# Altium schematic sheet microcontroller.SchDoc
size A; DocumentNumber: 3; SheetNumber: 3; SheetTotal: 7
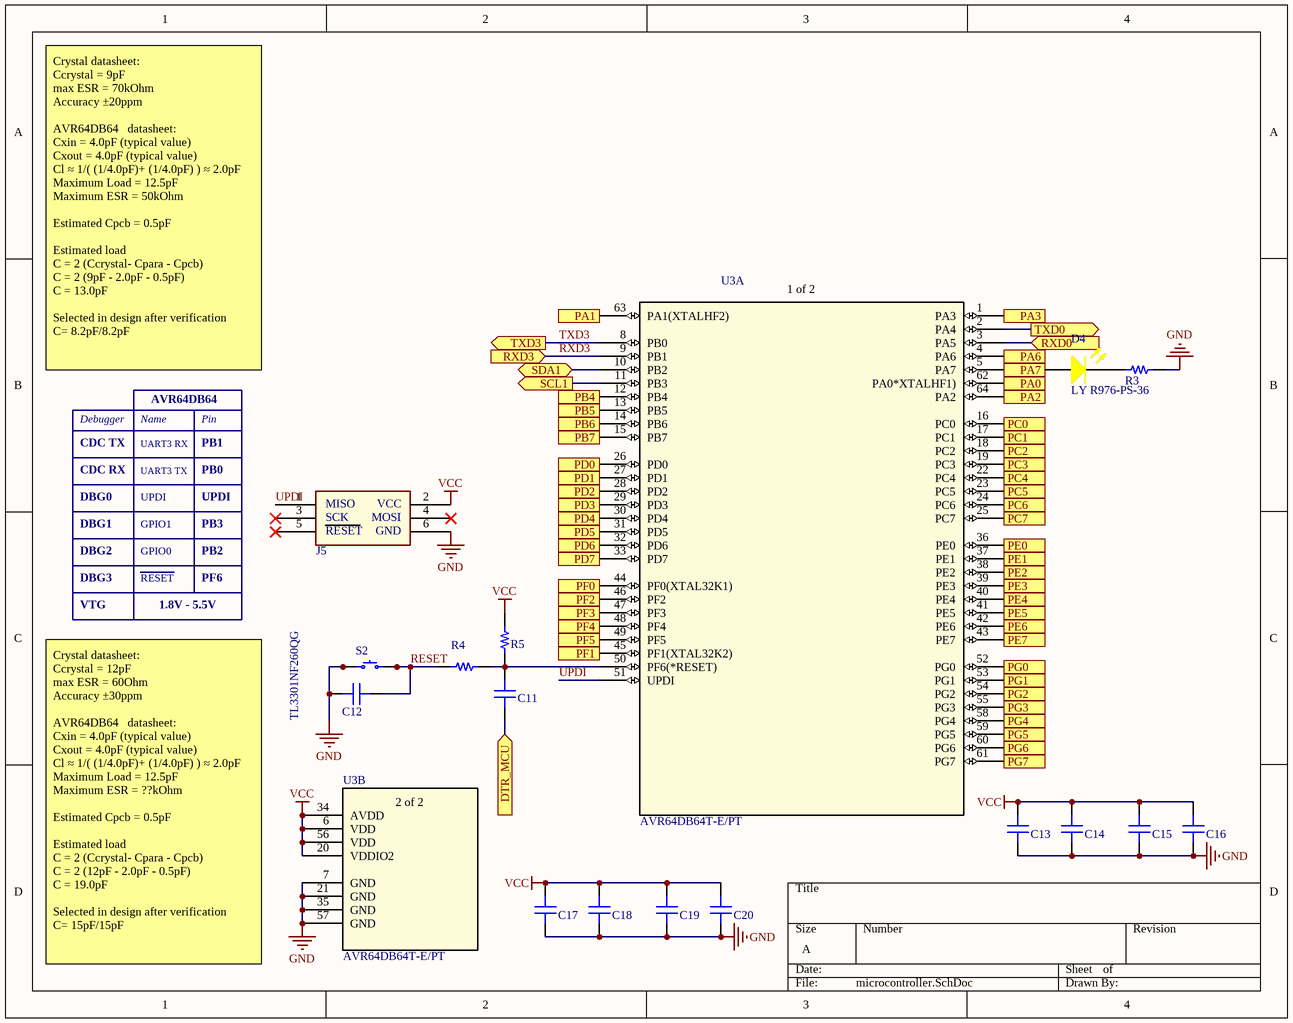
[diagram p0: microcontroller.SchDoc]

## Parts
C11  C0805C104M5RAC7025  [CAP SMD 0805]  (value not drawn)
C12  C0805C104M5RAC7025  [CAP SMD 0805]  (value not drawn)
C13  C0805C104M5RAC7025  [CAP SMD 0805]  (value not drawn)
C14  C0805C104M5RAC7025  [CAP SMD 0805]  (value not drawn)
C15  C0805C104M5RAC7025  [CAP SMD 0805]  (value not drawn)
C16  C0805C104M5RAC7025  [CAP SMD 0805]  (value not drawn)
C17  C0805C475K9PAC7210  [CAP SMD 0805]  (value not drawn)
C18  C0805C475K9PAC7210  [CAP SMD 0805]  (value not drawn)
C19  C0805C475K9PAC7210  [CAP SMD 0805]  (value not drawn)
C20  C0805C475K9PAC7210  [CAP SMD 0805]  (value not drawn)
D4  LY R976-PS-36  [LED 0805]
J5  HEADER 2x3  [2*3PIN_HEAD_2.54]  (value not drawn)
R3  1K  [RES SMD 0805]  (value not drawn)
R4  330R  [RES SMD 0805]  (value not drawn)
R5  10K  [RES SMD 0805]  (value not drawn)
S2  TL3301NF260QG  [Tactile Switche]
U3  AVR64DB64T-E/PT  [64-LQFP]  (parts A,B of 2)

## Ports
DTR_MCU (in), PA0 (out), PA1 (out), PA2 (out), PA3 (out), PA6 (out), PA7 (out), PB4 (out), PB5 (out), PB6 (out), PB7 (out), PC0 (out), PC1 (out), PC2 (out), PC3 (out), PC4 (out), PC5 (out), PC6 (out), PC7 (out), PD0 (out), PD1 (out), PD2 (out), PD3 (out), PD4 (out), PD5 (out), PD6 (out), PD7 (out), PE0 (out), PE1 (out), PE2 (out), PE3 (out), PE4 (out), PE5 (out), PE6 (out), PE7 (out), PF0 (out), PF1 (out), PF2 (out), PF3 (out), PF4 (out), PF5 (out), PG0 (out), PG1 (out), PG2 (out), PG3 (out), PG4 (out), PG5 (out), PG6 (out), PG7 (out), RXD0 (in), RXD3 (in), SCL1 (out), SDA1 (bidir), TXD0 (out), TXD3 (out)

## Nets
GND: C12.1 C13.1 C14.1 C15.1 C16.1 C17.1 C18.1 C19.1 C20.1 J5.6 R3.2 S2.1 S2.2 U3.7(GND) U3.21(GND) U3.35(GND) U3.57(GND)
VCC: C13.2 C14.2 C15.2 C16.2 C17.2 C18.2 C19.2 C20.2 J5.2 R5.2 U3.6(VDD) U3.20(VDDIO2) U3.34(AVDD) U3.56(VDD)
DTR_MCU: C11.1 ; port DTR_MCU
PA0: U3.62(PA0*XTALHF1)) ; port PA0
PA1: U3.63(PA1(XTALHF2)) ; port PA1
PA2: U3.64(PA2) ; port PA2
PA3: U3.1(PA3) ; port PA3
PA6: U3.4(PA6) ; port PA6
PA7: D4.2(Anode) U3.5(PA7) ; port PA7
PB4: U3.12(PB4) ; port PB4
PB5: U3.13(PB5) ; port PB5
PB6: U3.14(PB6) ; port PB6
PB7: U3.15(PB7) ; port PB7
PC0: U3.16(PC0) ; port PC0
PC1: U3.17(PC1) ; port PC1
PC2: U3.18(PC2) ; port PC2
PC3: U3.19(PC3) ; port PC3
PC4: U3.22(PC4) ; port PC4
PC5: U3.23(PC5) ; port PC5
PC6: U3.24(PC6) ; port PC6
PC7: U3.25(PC7) ; port PC7
PD0: U3.26(PD0) ; port PD0
PD1: U3.27(PD1) ; port PD1
PD2: U3.28(PD2) ; port PD2
PD3: U3.29(PD3) ; port PD3
PD4: U3.30(PD4) ; port PD4
PD5: U3.31(PD5) ; port PD5
PD6: U3.32(PD6) ; port PD6
PD7: U3.33(PD7) ; port PD7
PE0: U3.36(PE0) ; port PE0
PE1: U3.37(PE1) ; port PE1
PE2: U3.38(PE2) ; port PE2
PE3: U3.39(PE3) ; port PE3
PE4: U3.40(PE4) ; port PE4
PE5: U3.41(PE5) ; port PE5
PE6: U3.42(PE6) ; port PE6
PE7: U3.43(PE7) ; port PE7
PF0: U3.44(PF0(XTAL32K1)) ; port PF0
PF1: U3.45(PF1(XTAL32K2)) ; port PF1
PF2: U3.46(PF2) ; port PF2
PF3: U3.47(PF3) ; port PF3
PF4: U3.48(PF4) ; port PF4
PF5: U3.49(PF5) ; port PF5
PG0: U3.52(PG0) ; port PG0
PG1: U3.53(PG1) ; port PG1
PG2: U3.54(PG2) ; port PG2
PG3: U3.55(PG3) ; port PG3
PG4: U3.58(PG4) ; port PG4
PG5: U3.59(PG5) ; port PG5
PG6: U3.60(PG6) ; port PG6
PG7: U3.61(PG7) ; port PG7
RESET: C12.2 R4.2 S2.3 S2.4
RXD0: U3.3(PA5) ; port RXD0
RXD3: U3.9(PB1) ; port RXD3
SCL1: U3.11(PB3) ; port SCL1
SDA1: U3.10(PB2) ; port SDA1
TXD0: U3.2(PA4) ; port TXD0
TXD3: U3.8(PB0) ; port TXD3
UPDI: J5.1 U3.51(UPDI)
NetC11_2: C11.2 R4.1 R5.1 U3.50(PF6(*RESET))
NetD4_1: D4.1(Cathode) R3.1

Not connected (* = marked no-connect by the designer): J5 3* 4* 5*

## Notes on the sheet
- Crystal datasheet:
  Ccrystal = 9pF
  max ESR = 70kOhm
  Accuracy ±20ppm
  AVR64DB64   datasheet:
  Cxin = 4.0pF (typical value)
  Cxout = 4.0pF (typical value)
  Cl ≈ 1/( (1/4.0pF)+ (1/4.0pF) ) ≈ 2.0pF
  Maximum Load = 12.5pF
  Maximum ESR = 50kOhm
  Estimated Cpcb = 0.5pF
  Estimated load
  C = 2 (Ccrystal- Cpara - Cpcb)
  C = 2 (9pF - 2.0pF - 0.5pF)
  C = 13.0pF
  Selected in design after verification
  C= 8.2pF/8.2pF
- Debugger
- Name
- AVR64DB64
- Pin
- DBG0
- CDC TX
- CDC RX
- UPDI
- UART3 RX
- UART3 TX
- PB0
- PB1
- DBG1
- DBG2
- GPIO1
- GPIO0
- PB3
- PB2
- DBG3
- VTG
- RESET
- 1.8V - 5.5V
- PF6
- Crystal datasheet:
  Ccrystal = 12pF
  max ESR = 60Ohm
  Accuracy ±30ppm
  AVR64DB64   datasheet:
  Cxin = 4.0pF (typical value)
  Cxout = 4.0pF (typical value)
  Cl ≈ 1/( (1/4.0pF)+ (1/4.0pF) ) ≈ 2.0pF
  Maximum Load = 12.5pF
  Maximum ESR = ??kOhm
  Estimated Cpcb = 0.5pF
  Estimated load
  C = 2 (Ccrystal- Cpara - Cpcb)
  C = 2 (12pF - 2.0pF - 0.5pF)
  C = 19.0pF
  Selected in design after verification
  C= 15pF/15pF
- (in symbol AVR64DB64T-E/PT, part A) 1 of 2
- (in symbol AVR64DB64T-E/PT, part B) 2 of 2
- (in symbol HEADER 2x3) MISO; VCC; SCK; MOSI; RESET; GND

## Library data of the parts
C11-C16 = CAPACITOR X7R: 0.1 µF ±20% 50V Ceramic Capacitor X7R 0805 (2012 Metric)
C17-C20 = CAPACITOR X7R: 4.7 µF ±10% 6.3V Ceramic Capacitor X5R 0805 (2012 Metric)
D4 = SMD LED INDICATORS_2: LED YELLOW DIFFUSED 0805 SMD
J5 = HEADER 2x3: 2x3 pin header, 2.54 mm pitch, THM; PartGroup: Mechanical devices,Connectors,Pin headers; Manufacturer: SAMTEC; AN: A08-0538; Value: MTSW-103-08-L-D-276; TemperatureRange: max. 125 degrees; Height: 9,60000038146973; MPN: MTSW-103-08-L-D-276
R3 = RESISTOR_2: RES SMD 1K OHM 1% 1/4W 0805
R4 = RESISTOR: RES SMD 330 OHM 1% 1/4W 0805
R5 = RESISTOR: RES SMD 10K OHM 1% 1/4W 0805
S2 = 1571563-4: SWITCH TACTILE SPST-NO 0.05A 12V; Manufacturer: TE Connectivity ALCOSWITCH Switches; Actuator Height off PCB, Vertical: 5.00mm; Actuator Orientation: Top Actuated; Actuator Type: Standard; Contact Rating @ Voltage: 0.05A @ 24VDC; Illumination: Non-Illuminated; Operating Force: 260gf; Outline: 6.00mm x 6.00mm; Switch Function: Off-Mom; Part Number: 1571563-4; Circuit: SPST-NO; ComponentLink1Description: Datasheet; ComponentLink1URL: https://www.te.com/commerce/DocumentDelivery/DDEController?Action=srchrtrv&DocNm=1308111-1_SWITCHES_CORE_PROGRAM_CATALOG&DocType=CS&DocLang=English; ComponentLink2Description: DigiKey Link; ComponentLink2URL: http://digikey.com/product-detail/en/te-connectivity-alcoswitch-switches/1571563-4/450-2055-1-ND/4569745; LastUpdated: 2/4/2020 2:40:00 PM; Lifecycle Status: Active; Minimum Order: 1; Mounting Type: Surface Mount; Operating Temperature: -35°C ~ 85°C; Packaging: TapeAndReel; Part Status: Active; Price: 0.16; Series: FSMJSMA; Supplier 1: DigiKey; Supplier Part Number 1: 450-2055-1-ND; Termination Style: Gull Wing
U3 = AVR64DB64T-E/PT: AVR series Microcontroller IC 8-Bit 24MHz 64KB (64K x 8) FLASH 64-TQFP (10x10); Mfr_Name: Microchip; Copyright: Copyright (C) 2022 Ultra Librarian. All rights reserved.; Manufacturer_Part_Number: AVR64DB64T-E/PT; RefDes: RefDes; Type: DEV